# EAGLE design GPS_Breakout (EAGLE 6.2)
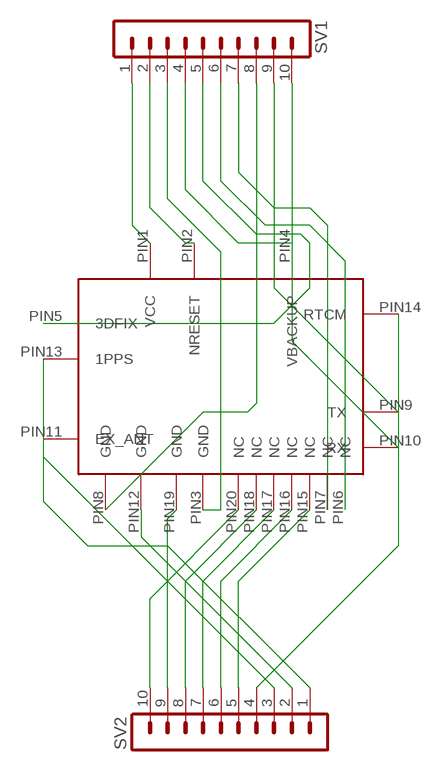
[diagram p0: schematic, sheet 1]

## Parts
SV1  MA10-1  [MA10-1]
SV2  MA10-1  [MA10-1]
U$1  GPS_FGPMMOPA6H  [FGPMMOPA6H_FOOTPRINT]

## Nets
N$1: SV1.1 U$1.PIN1(VCC)
N$2: SV1.2 U$1.PIN2(NRESET)
N$3: SV1.3 U$1.PIN3(GND)
N$4: SV1.4 U$1.PIN4(VBACKUP)
N$5: SV1.5 U$1.PIN5(3DFIX)
N$6: SV1.6 U$1.PIN6(NC)
N$7: SV1.7 U$1.PIN7(NC)
N$8: SV1.8 U$1.PIN8(GND)
N$9: SV1.9 U$1.PIN9(TX)
N$10: SV1.10 U$1.PIN10(RX)
N$11: SV2.1 U$1.PIN11(EX_ANT)
N$12: SV2.2 U$1.PIN12(GND)
N$13: SV2.3 U$1.PIN13(1PPS)
N$14: SV2.4 U$1.PIN14(RTCM)
N$15: SV2.5 U$1.PIN15(NC)
N$16: SV2.6 U$1.PIN16(NC)
N$17: SV2.7 U$1.PIN17(NC)
N$18: SV2.8 U$1.PIN18(NC)
N$19: SV2.9 U$1.PIN19(GND)
N$20: SV2.10 U$1.PIN20(NC)

## Library data of the parts
SV1 SV2 = con-lstb:MA10-1: PIN HEADER; OC_FARNELL: unknown; OC_NEWARK: unknown
U$1 = RobThePyro:GPS_FGPMMOPA6H

## Board
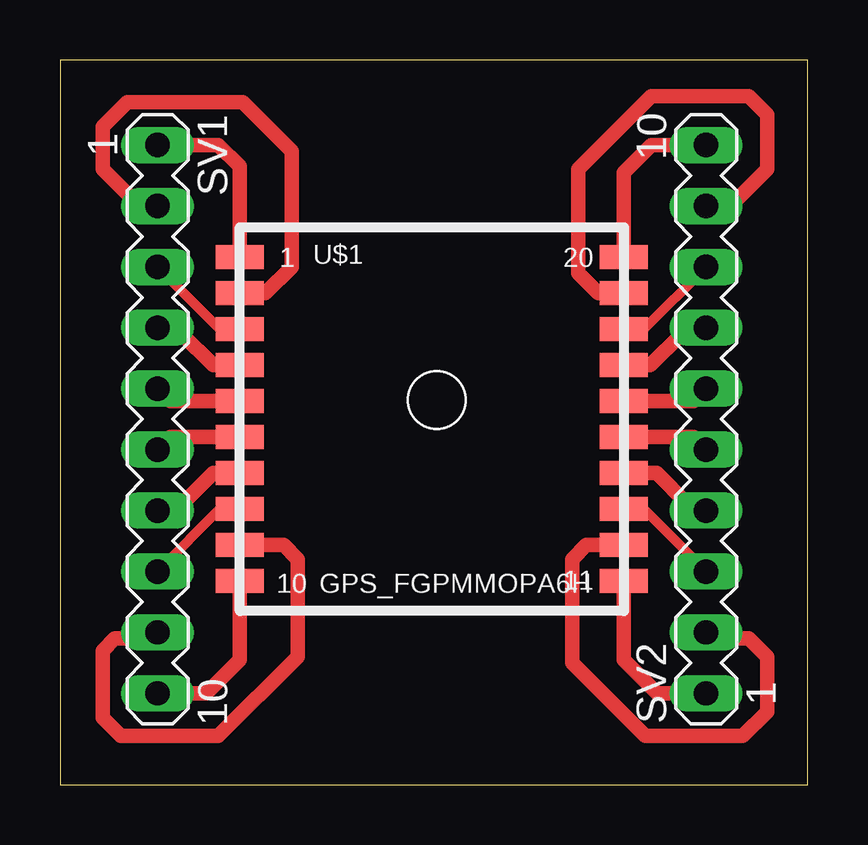
[diagram p1: board, top side]

Size 31.17 x 30.22 mm. Coordinates in mm from the lower left corner, seen from the top.
Outline: 0,0 31.17,0 31.17,30.22 0,30.22 0,0
Copper layers (1*16): Top 0.035mm / dielectric 1.5mm / Bottom 0.035mm
Design rules: minimum track width 10mil, minimum drill 24mil, track to track 8mil, track to pad 8mil, pad to pad 8mil, via to via 8mil, smd to smd 8mil, copper to edge 40mil, drill to drill 8mil, minimum pad ring 10mil, minimum via ring 8mil, stop-mask expansion 4mil, vias tented up to drill 0mil, thermal gap 10mil

### Footprints (pad centres in the part's own frame; a part is rotated, then mirrored left to right if it is on the bottom)
MA10-1 = drill 1.016 long: 1 -11.43,0; 2 -8.89,0; 3 -6.35,0; 4 -3.81,0; 5 -1.27,0; 6 1.27,0; 7 3.81,0; 8 6.35,0; 9 8.89,0; 10 11.43,0
FGPMMOPA6H_FOOTPRINT = smd 2 x 1: PIN1 -8,6.75; PIN2 -8,5.25; PIN3 -8,3.75; PIN4 -8,2.25; PIN5 -8,0.75; PIN6 -8,-0.75; PIN7 -8,-2.25; PIN8 -8,-3.75; PIN9 -8,-5.25; PIN10 -8,-6.75; PIN11 8,-6.75; PIN12 8,-5.25; PIN13 8,-3.75; PIN14 8,-2.25; PIN15 8,-0.75; PIN16 8,0.75; PIN17 8,2.25; PIN18 8,3.75; PIN19 8,5.25; PIN20 8,6.75

### Placement (x,y rotation side)
SV1  4.06,15.24 270 top
SV2  26.92,15.24 90 top
U$1  15.49,15.24 0 top

### Tracks (layer width: path | path; a pad name or v marks a point on that pad's centre or on a via)
N$1
  Top 0.61: U$1.PIN1 7.49,25.78 6.6,26.67 SV1.1
N$2
  Top 0.61: U$1.PIN2 8.55,20.49 9.65,21.59 9.65,26.42 7.62,28.45 2.79,28.45 1.78,27.43 1.78,25.65 3.05,24.38 3.81,24.38 SV1.2
N$3
  Top 0.406: U$1.PIN3 6.66,18.99 SV1.3
N$4
  Top 0.61: U$1.PIN4 6.39,17.49 5.08,18.8 4.32,18.8 SV1.4
N$5
  Top 0.61: U$1.PIN5 4.58,15.99 SV1.5
N$6
  Top 0.61: U$1.PIN6 4.58,14.49 SV1.6
N$7
  Top 0.61: U$1.PIN7 6.39,12.99 5.08,11.68 4.32,11.68 SV1.7
N$8
  Top 0.406: U$1.PIN8 6.66,11.49 SV1.8
N$9
  Top 0.61: U$1.PIN9 9.31,9.99 9.91,9.4 9.91,5.33 6.6,2.03 2.54,2.03 1.78,2.79 1.78,5.59 2.29,6.1 3.81,6.1 SV1.9
N$10
  Top 0.61: U$1.PIN10 7.49,5.21 6.1,3.81 SV1.10
N$11
  Top 0.61: U$1.PIN11 23.49,5.21 24.89,3.81 SV2.1
N$12
  Top 0.61: U$1.PIN12 21.93,9.99 21.34,9.4 21.34,5.08 24.38,2.03 28.45,2.03 29.46,3.05 29.46,5.33 28.7,6.1 27.18,6.1 SV2.2
N$13
  Top 0.406: U$1.PIN13 24.32,11.49 SV2.3
N$14
  Top 0.61: U$1.PIN14 24.86,12.99 26.16,11.68 26.67,11.68 SV2.4
N$15
  Top 0.61: U$1.PIN15 26.4,14.49 SV2.5
N$16
  Top 0.61: U$1.PIN16 26.4,15.99 SV2.6
N$17
  Top 0.61: U$1.PIN17 24.6,17.49 25.91,18.8 26.67,18.8 SV2.7
N$18
  Top 0.406: U$1.PIN18 24.32,18.99 SV2.8
N$19
  Top 0.61: U$1.PIN19 22.44,20.49 21.59,21.34 21.59,25.65 24.64,28.7 28.7,28.7 29.46,27.94 29.46,25.65 28.19,24.38 27.18,24.38 SV2.9
N$20
  Top 0.61: U$1.PIN20 23.49,25.53 24.64,26.67 SV2.10